# EAGLE schematic 9xVoice MikeB TH v1 (EAGLE 6.3)
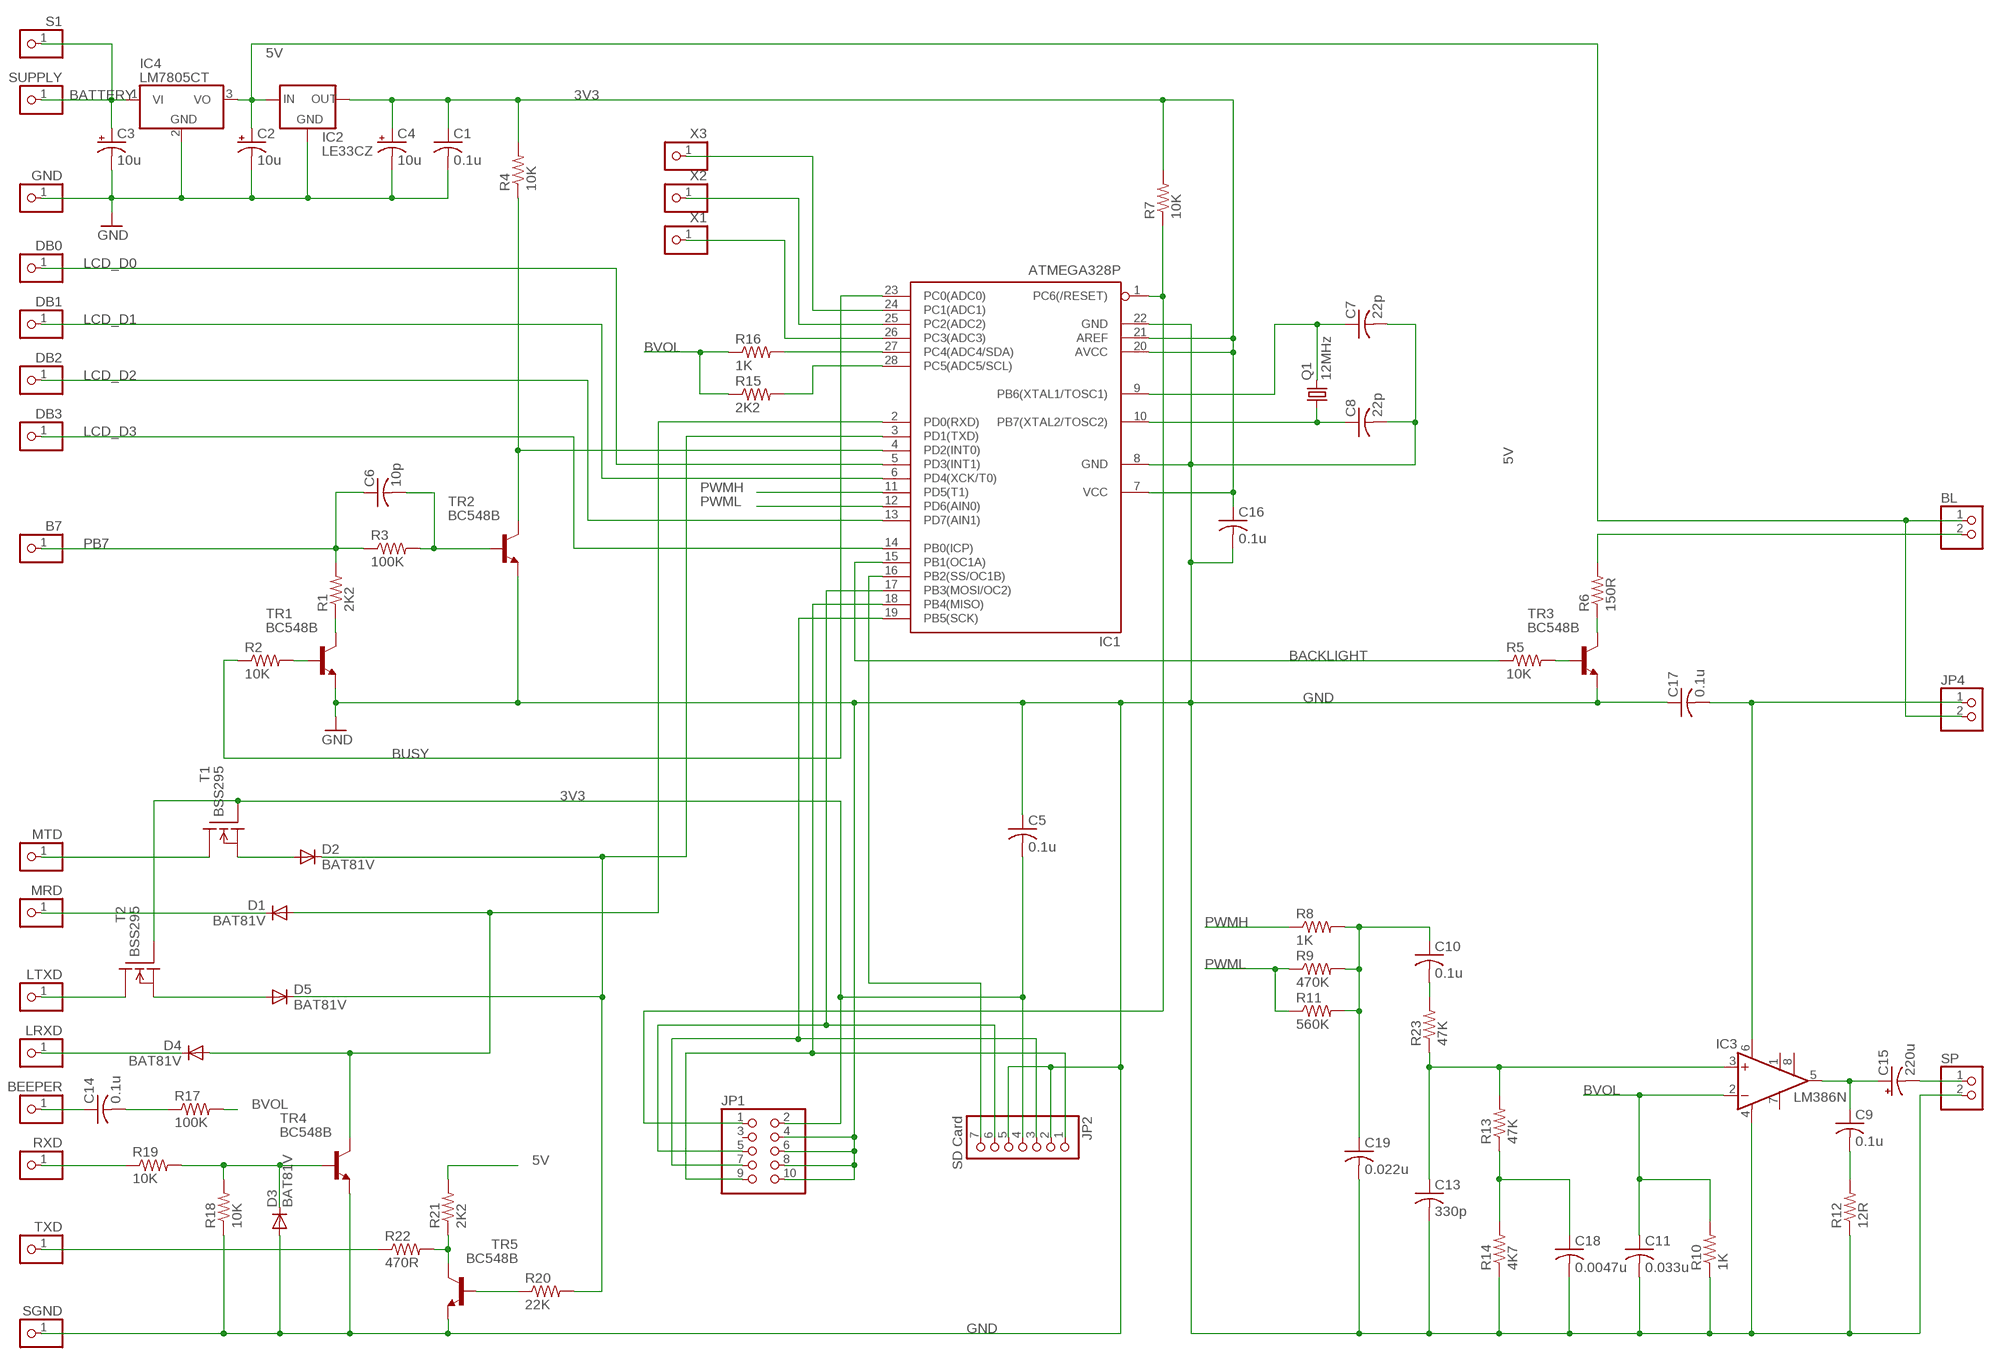
[diagram p0: schematic, sheet 1]

## Parts
B7  PINHD-1X1  [1X01]
BEEPER  PINHD-1X1  [1X01]
BL  PINHD-1X2  [1X02]
C1  0.1u  C-US025-024X044  [C025-024X044]
C2  10u  CPOL-USE1.8-4  [E1,8-4]
C3  10u  CPOL-USE1.8-4  [E1,8-4]
C4  10u  CPOL-USE1.8-4  [E1,8-4]
C5  0.1u  C-US025-024X044  [C025-024X044]
C6  10p  C-US025-024X044  [C025-024X044]
C7  22p  C-US025-024X044  [C025-024X044]
C8  22p  C-US025-024X044  [C025-024X044]
C9  0.1u  C-US025-024X044  [C025-024X044]
C10  0.1u  C-US025-024X044  [C025-024X044]
C11  0.033u  C-US025-024X044  [C025-024X044]
C13  330p  C-US025-024X044  [C025-024X044]
C14  0.1u  C-US025-024X044  [C025-024X044]
C15  220u  CPOL-USE2.5-7  [E2,5-7]
C16  0.1u  C-US025-024X044  [C025-024X044]
C17  0.1u  C-US025-024X044  [C025-024X044]
C18  0.0047u  C-US025-024X044  [C025-024X044]
C19  0.022u  C-US025-024X044  [C025-024X044]
D1  BAT81V  DIODE-D-2.5  [D-2.5]
D2  BAT81V  DIODE-D-2.5  [D-2.5]
D3  BAT81V  DIODE-D-2.5  [D-2.5]
D4  BAT81V  DIODE-D-2.5  [D-2.5]
D5  BAT81V  DIODE-D-2.5  [D-2.5]
DB0  PINHD-1X1  [1X01]
DB1  PINHD-1X1  [1X01]
DB2  PINHD-1X1  [1X01]
DB3  PINHD-1X1  [1X01]
GND  PINHD-1X1  [1X01]
IC1  ATMEGA328P  MEGA8-P  [DIL28-3]
IC2  LE33CZ  78LXX  [78LXX]
IC3  LM386N  LM386N-1  [DIL08]
IC4  LM7805CT  7805T  [TO220H]
JP1  PINHD-2X5  [2X05]
JP2  SD Card  PINHD-1X7  [1X07]
JP4  PINHD-1X2  [1X02]
LRXD  PINHD-1X1  [1X01]
LTXD  PINHD-1X1  [1X01]
MRD  PINHD-1X1  [1X01]
MTD  PINHD-1X1  [1X01]
Q1  12MHz  CRYSTALHC49S  [HC49/S]
R1  2K2  R-US_0207/2V  [0207/2V]
R2  10K  R-US_0207/10  [0207/10]
R3  100K  R-US_0207/2V  [0207/2V]
R4  10K  R-US_0207/2V  [0207/2V]
R5  10K  R-US_0207/2V  [0207/2V]
R6  150R  R-US_0207/2V  [0207/2V]
R7  10K  R-US_0207/2V  [0207/2V]
R8  1K  R-US_0207/2V  [0207/2V]
R9  470K  R-US_0207/2V  [0207/2V]
R10  1K  R-US_0207/2V  [0207/2V]
R11  560K  R-US_0207/2V  [0207/2V]
R12  12R  R-US_0207/2V  [0207/2V]
R13  47K  R-US_0207/2V  [0207/2V]
R14  4K7  R-US_0207/2V  [0207/2V]
R15  2K2  R-US_0207/2V  [0207/2V]
R16  1K  R-US_0207/2V  [0207/2V]
R17  100K  R-US_0207/2V  [0207/2V]
R18  10K  R-US_0207/2V  [0207/2V]
R19  10K  R-US_0207/2V  [0207/2V]
R20  22K  R-US_0207/2V  [0207/2V]
R21  2K2  R-US_0207/2V  [0207/2V]
R22  470R  R-US_0207/2V  [0207/2V]
R23  47K  R-US_0207/2V  [0207/2V]
RXD  PINHD-1X1  [1X01]
S1  PINHD-1X1  [1X01]
SGND  PINHD-1X1  [1X01]
SP  PINHD-1X2  [1X02]
SUPPLY  PINHD-1X1  [1X01]
T1  BSS295  [TO92]
T2  BSS295  [TO92]
TR1  BC548B  [TO92-EBC]
TR2  BC548B  [TO92-EBC]
TR3  BC548B  [TO92-EBC]
TR4  BC548B  [TO92-EBC]
TR5  BC548B  [TO92-EBC]
TXD  PINHD-1X1  [1X01]
X1  PINHD-1X1  [1X01]
X2  PINHD-1X1  [1X01]
X3  PINHD-1X1  [1X01]

## Nets
3V3: C1.1 C4.+ C5.2 C16.1 IC1.7(VCC) IC1.20(AVCC) IC1.21(AREF) IC2.OUT JP1.2 JP2.4 R4.2 R7.2 T1.1(G) T2.1(G)
5V: BL.1 C2.+ IC2.IN IC4.3(VO) JP4.2 R21.2
BACKLIGHT: IC1.15(PB1(OC1A)) R5.1
BATTERY: C3.+ IC4.1(VI) S1.1 SUPPLY.1
BUSY: IC1.23(PC0(ADC0)) R2.1
BVOL: C11.1 IC3.2(-IN) R10.2 R15.1 R16.1 R17.2
GND: C1.2 C2.- C3.- C4.- C5.1 C7.2 C8.2 C11.2 C13.2 C16.2 C17.1 C18.2 C19.2 D3.A GND.1 IC1.8(GND) IC1.22(GND) IC2.GND IC3.4(GND) IC4.2(GND) JP1.4 JP1.6 JP1.8 JP1.10 JP2.2 JP2.5 R10.1 R12.1 R14.1 R18.1 SGND.1 SP.2 TR1.E TR2.E TR3.E TR4.E TR5.E
LCD_D0: DB0.1 IC1.5(PD3(INT1))
LCD_D1: DB1.1 IC1.6(PD4(XCK/T0))
LCD_D2: DB2.1 IC1.13(PD7(AIN1))
LCD_D3: DB3.1 IC1.14(PB0(ICP))
MISO: IC1.18(PB4(MISO)) JP1.9 JP2.1
MOSI: IC1.17(PB3(MOSI/OC2)) JP1.5 JP2.6
N$2: R21.1 R22.2 TR5.C
N$3: R22.1 TXD.1
N$4: R20.1 TR5.B
N$5: IC1.28(PC5(ADC5/SCL)) R15.2
N$6: IC1.27(PC4(ADC4/SDA)) R16.2
N$7: IC1.26(PC3(ADC3)) X1.1
N$8: IC1.25(PC2(ADC2)) X2.1
N$9: IC1.24(PC1(ADC1)) X3.1
N$10: R19.1 RXD.1
N$11: D3.C R18.2 R19.2 TR4.B
N$12: D4.C LRXD.1
N$14: D5.A T2.3(S)
N$15: D2.A T1.3(S)
N$16: MTD.1 T1.2(D)
N$17: LTXD.1 T2.2(D)
N$18: D1.C MRD.1
N$21: R1.1 TR1.C
N$22: R2.2 TR1.B
N$23: C6.2 R3.2 TR2.B
N$24: BEEPER.1 C14.1
N$25: C14.2 R17.1
N$26: R5.2 TR3.B
N$27: R6.1 TR3.C
N$28: C10.2 R23.2
N$29: IC1.4(PD2(INT0)) R4.1 TR2.C
N$30: C8.1 IC1.10(PB7(XTAL2/TOSC2)) Q1.1
N$31: C7.1 IC1.9(PB6(XTAL1/TOSC1)) Q1.2
N$33: BL.2 R6.2
N$34: C9.1 C15.+ IC3.5(OUT)
N$35: C9.2 R12.2
N$36: C15.- SP.1
N$37: C17.2 IC3.6(VS) JP4.1
N$38: C13.1 IC3.3(+IN) R13.2 R23.1
N$39: C10.1 C19.1 R8.2 R9.2 R11.2
N$40: C18.1 R13.1 R14.2
PB7: B7.1 C6.1 R1.2 R3.1
PWMH: IC1.11(PD5(T1)) R8.1
PWML: IC1.12(PD6(AIN0)) R9.1 R11.1
RESET: IC1.1(PC6(/RESET)) JP1.1 R7.1
RXD: D1.A D4.A IC1.2(PD0(RXD)) TR4.C
SCK: IC1.19(PB5(SCK)) JP1.7 JP2.3
SS: IC1.16(PB2(SS/OC1B)) JP2.7
TXD: D2.C D5.C IC1.3(PD1(TXD)) R20.2
Unconnected: IC3.1(GAIN) IC3.7(BYPASS) IC3.8(GAIN) JP1.3

## Library data of the parts
B7 BEEPER DB0 DB1-DB3 GND LRXD LTXD MRD MTD RXD S1 SGND SUPPLY TXD X1-X3 = pinhead:PINHD-1X1: PIN HEADER
BL JP4 SP = pinhead:PINHD-1X2: PIN HEADER
C1 C5-C11 C13 C14 C16-C19 = rcl:C-US: CAPACITOR, American symbol
C2-C4 C15 = rcl:CPOL-US: POLARIZED CAPACITOR, American symbol
D1-D5 = diode:DIODE-: DIODE
IC1 = atmel:MEGA8-P: MICROCONTROLLER 8 Kbytes FLASH, 1 kbytes SRAM, 512 bytes EEPROM, USART, 4-channel 10 bit ADC, 2-channel 8 bit ADC Pin compatible with Atmega48, ATMega88, ATMega168 Source: avr.lbr; OC_FARNELL: unknown; OC_NEWARK: unknown
IC2 = v-reg:78LXX: VOLTAGE REGULATOR
IC3 = linear:LM386?-*: Low Voltage Audio Power Amplifier Source: http://cache.national.com/ds/LM/LM386.pdf
IC4 = linear:78*: Positive VOLTAGE REGULATOR Source: http://cache.national.com/ds/LM/LM78L05.pdf http://www.fairchildsemi.com/ds/LM/LM7805.pdf
JP1 = pinhead:PINHD-2X5: PIN HEADER
JP2 = pinhead:PINHD-1X7: PIN HEADER
Q1 = crystal:CRYSTAL: CRYSTAL; OC_FARNELL: 1667008; OC_NEWARK: unknown
R1-R23 = rcl:R-US_: RESISTOR, American symbol
T1 T2 = transistor-fet:BSS295: N-Channel Enhancement MOSFET not checked
TR1-TR5 = transistor-npn:BC548*: NPN Transistor